# Altium schematic sheet PowerControl.SchDoc
size A4
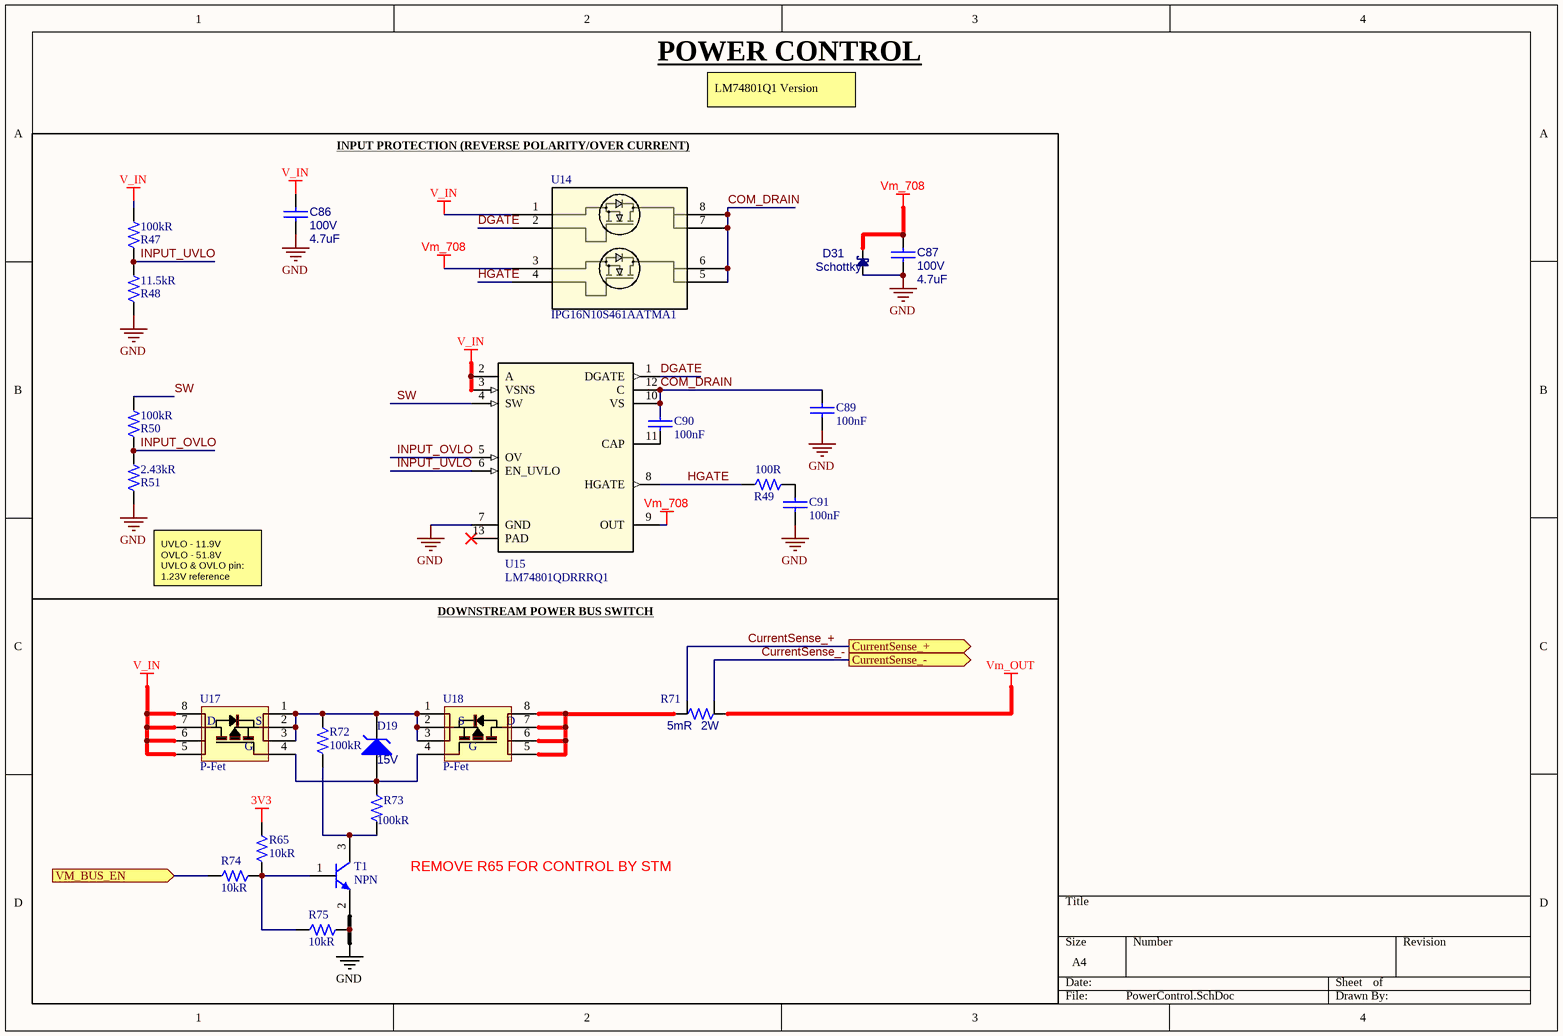
[diagram p0: PowerControl.SchDoc]

## Parts
C86  value 4.7uF  Voltage: 100V  [CAP1210]  (hidden comment: Capacitor)
C87  value 4.7uF  Voltage: 100V  [CAP1210]  (hidden comment: Capacitor)
C89  Capacitance: 100nF  [CAP0402]  (hidden comment: Capacitor)
C90  Capacitance: 100nF  [CAP0402]  (hidden comment: Capacitor)
C91  Capacitance: 100nF  [CAP0402]  (hidden comment: Capacitor)
D19  Zener Voltage: 15V  [SOD-323F]  (hidden comment: Zener)
D31  Schottky  [DO-214AC]
R47  Resistance: 100kR  [RES0402]  (hidden comment: Resistor)
R48  Resistance: 11.5kR  [RES0402]  (hidden comment: Resistor)
R49  Resistance: 100R  [RES0402]  (hidden comment: Resistor)
R50  Resistance: 100kR  [RES0402]  (hidden comment: Resistor)
R51  Resistance: 2.43kR  [RES0402]  (hidden comment: Resistor)
R65  Resistance: 10kR  [RES0402]  (hidden comment: Resistor)
R71  Resistance: 5mR  Power Rating: 2W  [RES2512 - KELVIN]  (hidden comment: Resistor_Kelvin)
R72  Resistance: 100kR  [RES0402]  (hidden comment: Resistor)
R73  Resistance: 100kR  [RES0402]  (hidden comment: Resistor)
R74  Resistance: 10kR  [RES0402]  (hidden comment: Resistor)
R75  Resistance: 10kR  [RES0402]  (hidden comment: Resistor)
T1  NPN  [DFN2020D-3]
U14  IPG16N10S461AATMA1  [PG-TDSON-8-4_INF]
U15  LM74801QDRRRQ1  [DRR0012E]
U17  P-Fet  [SO-8_PowerPAK]
U18  P-Fet  [SO-8_PowerPAK]

## Blocks framed on the sheet
INPUT PROTECTION (REVERSE POLARITY/OVER CURRENT): C86 C87 C89-C91 D31 R47-R51 U14 U15
REMOVE R65 FOR CONTROL BY STM: D19 R65 R71-R75 T1 U17 U18

## Ports
CurrentSense_+ (out), CurrentSense_- (out), VM_BUS_EN (in)

## Nets
3V3: R65.2
GND: C86.2 C87.2 C89.2 C91.2 D31.2 R48.1 R51.1 R75.2 T1.2(E) U15.7(GND)
V_IN: C86.1 R47.2 U14.1 U15.2(A) U15.3(VSNS) U17.5 U17.6 U17.7 U17.8
Vm_708: C87.1 D31.1 U14.3 U15.9(OUT)
Vm_OUT: R71.2
COM_DRAIN: C89.1 C90.1 U14.5 U14.6 U14.7 U14.8 U15.10(VS) U15.12(C)
CurrentSense_+: R71.3 ; port CurrentSense_+
CurrentSense_-: R71.4 ; port CurrentSense_-
DGATE: U14.2 U15.1(DGATE)
HGATE: R49.2 U14.4 U15.8(HGATE)
INPUT_OVLO: R50.1 R51.2 U15.5(OV)
INPUT_UVLO: R47.1 R48.2 U15.6(EN_UVLO)
SW: R50.2 U15.4(SW)
VM_BUS_EN: R74.1 ; port VM_BUS_EN
NetC90_2: C90.2 U15.11(CAP)
NetC91_1: C91.1 R49.1
NetD19_1: D19.1 R72.1 U17.1(G) U17.2(S) U17.3(D) U18.1(G) U18.2(S) U18.3(D)
NetD19_2: D19.2 R73.1 U17.4 U18.4
NetR65_1: R65.1 R74.2 R75.1 T1.1(B)
NetR71_1: R71.1 U18.5 U18.6 U18.7 U18.8
NetR72_2: R72.2 R73.2 T1.3(C)

Not connected (* = marked no-connect by the designer): U15 13(PAD)*

## Notes on the sheet
- POWER CONTROL
- LM74801Q1 Version
- (near R51) UVLO - 11.9V
  OVLO - 51.8V
  UVLO & OVLO pin:
  1.23V reference
- DOWNSTREAM POWER BUS SWITCH

## Library data of the parts
C86 C87 = Capacitor: Cap Ceramic 4.7uF 100V X7S 10% Pad SMD 1210 Soft Termination 125°C Automotive T/R; Manufacturer 1: Murata; Manufacturer Part Number 1: GCJ32DC72A475KE01L; Manufacturer: *; Manufacturer Part Number: *; Supplier: *; Supplier Part Number: *; Tolerance: 10%; Footprint: 1210; Temperature Coefficient: X7S; Supplier 1: Digi-Key; Supplier Part Number 1: 490-16466-1-ND; RoHS: Yes; Category: Ceramic Capacitors; Pricing 1: 1=1,37000, 10=1,07800, 50=0,93460, 100=0,80890, 500=0,61114 (USD); RoHS Compliant: Yes; ComponentLink1URL: https://search.murata.co.jp/Ceramy/image/img/A01X/G101/ENG/GCJ32DC72A475KE01-01.pdf?src-supplier=Digi-Key; ComponentLink1Description: https://search.murata.co.jp/Ceramy/image/img/A01X/G101/ENG/GCJ32DC72A475KE01-01.pdf?src-supplier=Digi-Key
C89-C91 = Capacitor: Cap Ceramic 0.1uF 35V X7R 20% SMD 0402 125°C Punched Paper T/R; Manufacturer: *; Manufacturer Part Number: *; Supplier: *; Supplier Part Number: *; Tolerance: *; Voltage: *; Footprint: *; Temperature Coefficient: *; Supplier 1: Digi-Key; Supplier Part Number 1: 445-12264-1-ND; RoHS: Yes; Category: Ceramic Capacitors; Stock 1: 20636; Pricing 1: 1=0.14000, 10=0.10200, 50=0.05780, 100=0.04780, 500=0.03356, 1000=0.02778, 2500=0.02585, 5000=0.02365 (USD); Mount: Surface Mount; Case/Package: 0402; Case Code (Metric): 1005; Case Code (Imperial): 0402; Weight: 2.3E-05oz; Min Operating Temperature: -55°C; Max Operating Temperature: 125°C; Voltage Rating: 35V; Package Quantity: 10000; Packaging: Tape and Reel; Dielectric: X7R; Voltage Rating (DC): 35V; Series: CGA; Length: 0.039inch; Width: 0.02inch; Height: 0.5mm; Thickness: 0.022inch; Ratings: AEC-Q200; RoHS Compliant: Yes; ComponentLink1URL: http://www.mouser.com/ds/2/400/lcc_automotive_general_en-843974.pdf?src-supplier=Mouser; ComponentLink1Description: http://www.mouser.com/ds/2/400/lcc_automotive_general_en-843974.pdf?src-supplier=Mouser; ComponentLink2URL: https://product.tdk.com/info/en/catalog/datasheets/mlcc_automotive_general_en.pdf?src-supplier=Digi-Key; ComponentLink2Description: https://product.tdk.com/info/en/catalog/datasheets/mlcc_automotive_general_en.pdf?src-supplier=Digi-Key; ComponentLink3URL: https://product.tdk.com/info/en/documents/chara_sheet/CGA2B3X7R1V104M050BB.pdf?src-supplier=Digi-Key; ComponentLink3Description: https://product.tdk.com/info/en/documents/chara_sheet/CGA2B3X7R1V104M050BB.pdf?src-supplier=Digi-Key; ComponentLink4URL: http://product.tdk.com/en/catalog/datasheets/mlcc_automotive_general_en.pdf?src-supplier=Avnet; ComponentLink4Description: http://product.tdk.com/en/catalog/datasheets/mlcc_automotive_general_en.pdf?src-supplier=Avnet
D19 = Diode_Zener: Manufacturer 1: NXP Semiconductors; Manufacturer Part Number 1: BZX84J-B15.115; Power Dissopation: 500mW; Supplier 1: Digi-Key; Supplier Part Number 1: 1727-6257-1-ND; RoHS: No; Category: Zener Diodes; Stock 1: 78829; Pricing 1: 1=0,24000, 10=0,16700, 100=0,08150, 500=0,06798, 1000=0,04724 (USD); Packaging: Tape and Reel; Lead Free: Lead Free; Working Voltage: 15V; Voltage Rating (DC): 15V; Case/Package: *; Parameter 6: *
D31 = Diode_Shottky_2: DIODE SCHOTTKY 5A 60V SMA; Manufacturer 1: MCC; Manufacturer Part Number 1: SK56A-LTP; Supplier 1: Digi-Key; Supplier Part Number 1: SK56A-LTPMSCT-ND; RoHS: Yes; Category: Rectifier Diodes; Stock 1: 27361; Pricing 1: 1=0,51000, 10=0,41400, 100=0,28160, 500=0,21120, 1000=0,15840, 2000=0,14520 (USD); Mount: Surface Mount; Case/Package: SMA; Packaging: Tape and Reel; Average Rectified Current: 5A; Max Reverse Voltage (DC): 60V; RoHS Compliant: Yes; ComponentLink1URL: http://www.mccsemi.com/up_pdf/SK52A-L-SK510A-L(DO-214AC).pdf?src-supplier=Digi-Key; ComponentLink1Description: http://www.mccsemi.com/up_pdf/SK52A-L-SK510A-L(DO-214AC).pdf?src-supplier=Digi-Key
R47 R50 = Resistor: Res Thick Film 0402 100K Ohm 1% 0.063W(1/16W) ±100ppm/C Sulfur Resistant Pad SMD Automotive T/R; Manufacturer: Yageo; Manufacturer Part Number: AF0402FR-07100KL; Max Power Dissipation: 63mW; Temperature Coefficient: 100ppm/°C; Supplier 1: Digi-Key; Supplier Part Number 1: 13-AF0402FR-07100KLCT-ND; RoHS: Yes; Category: Chip SMD Resistors; Stock 1: 45999; Pricing 1: 1=0.10000, 10=0.06100, 100=0.02470, 1000=0.01109, 2500=0.00963, 5000=0.00795 (USD); Case/Package: 0402; Min Operating Temperature: -55°C; Max Operating Temperature: 155°C; Packaging: Tape and Reel; Resistor Type: Thick Film; Number of Terminations: 2; Tolerance: 1%; Features: Moisture Resistant,Anti-Sulfur; Length: 0.039inch; Width: 0.02inch; Height: 0.015inch; RoHS Compliant: Yes; ComponentLink1URL: http://www.yageo.com/documents/recent/PYu-AF_51_RoHS_L_5.pdf?src-supplier=Digi-Key; ComponentLink1Description: http://www.yageo.com/documents/recent/PYu-AF_51_RoHS_L_5.pdf?src-supplier=Digi-Key
R48 = Resistor: Res Thick Film 0402 11.5K Ohm 1% 0.063W(1/16W) ±100ppm/C Pad SMD Automotive T/R; Manufacturer: Yageo; Manufacturer Part Number: AC0402FR-0711K5L; Max Power Dissipation: 63mW; Temperature Coefficient: 100ppm/°C; Supplier 1: Digi-Key; Supplier Part Number 1: 13-AC0402FR-0711K5LCT-ND; RoHS: Yes; Category: Chip SMD Resistors; Stock 1: 58308; Pricing 1: 1=0.10000, 10=0.02200, 100=0.00900, 1000=0.00402, 2500=0.00349, 5000=0.00288 (USD); Case/Package: 0402; Min Operating Temperature: -55°C; Max Operating Temperature: 155°C; Packaging: Tape and Reel; Resistor Type: Thick Film; Number of Terminations: 2; Tolerance: 1%; Features: Moisture Resistant,Automotive AEC-Q200; Length: 0.039inch; Width: 0.02inch; Height: 0.015inch; RoHS Compliant: Yes; ComponentLink1URL: http://www.yageo.com/NewPortal/yageodocoutput?fileName=/pdf/R-Chip/PYu-AC_51_RoHS_L_6.pdf&src-supplier=Digi-Key; ComponentLink1Description: http://www.yageo.com/NewPortal/yageodocoutput?fileName=/pdf/R-Chip/PYu-AC_51_RoHS_L_6.pdf&src-supplier=Digi-Key
R49 = Resistor: Res Thick Film 0402 100 Ohm 0.5% 0.063W ±50ppm/°C Molded SMD Punched Carrier T/R; Manufacturer: Panasonic; Manufacturer Part Number: ERJ-2RHD1000X; Power Rating: 63mW; Voltage Rating: 50V; Supplier 1: Digi-Key; Supplier Part Number 1: P15983CT-ND; RoHS: Yes; Category: Chip SMD Resistors; Stock 1: 2; Pricing 1: 1=0.13000, 10=0.11400, 100=0.04370, 1000=0.01923, 2500=0.01661, 5000=0.01486 (USD); Mount: Surface Mount; Case/Package: 0402; Case Code (Imperial): 0402; Case Code (Metric): 1005; Contact Plating: Tin; Min Operating Temperature: -55°C; Max Operating Temperature: 125°C; Packaging: Tape and Reel; Tolerance: 0.5%; Package Quantity: 10000; Resistor Type: Thick Film; Termination: SMD/SMT; Temperature Coefficient: 50ppm/°C; Voltage Rating (DC): 50V; Features: Automotive AEC-Q200; Series: ERJ; Max Power Dissipation: 63mW; Number of Terminations: 2; Technology: THICK FILM; Resistance Tolerance: 0.5%; Length: 1mm; Width: 0.5mm; Height: 0.35mm; Depth: 0.5mm; Radiation Hardening: No; REACH SVHC: No SVHC; RoHS Compliant: Yes; ComponentLink1URL: https://datasheet.ciiva.com/46438/1678782-46438252.pdf?src-supplier=Element14; ComponentLink1Description: https://datasheet.ciiva.com/46438/1678782-46438252.pdf?src-supplier=Element14; ComponentLink2URL: https://datasheet.ciiva.com/24071/aoa0000ce2-24071912.pdf?src-supplier=Mouser; ComponentLink2Description: https://datasheet.ciiva.com/24071/aoa0000ce2-24071912.pdf?src-supplier=Mouser; ComponentLink3URL: https://datasheet.ciiva.com/9119/aoa0000ce2-9119196.pdf?src-supplier=Avnet; ComponentLink3Description: https://datasheet.ciiva.com/9119/aoa0000ce2-9119196.pdf?src-supplier=Avnet; ComponentLink4URL: https://datasheet.ciiva.com/43511/aoa0000ce2-43511452.pdf?src-supplier=Onlinecomponents.com; ComponentLink4Description: https://datasheet.ciiva.com/43511/aoa0000ce2-43511452.pdf?src-supplier=Onlinecomponents.com
R51 = Resistor: Res Anti Sulfur 0402 2.43K Ohm 1/16W 1% SMD; Manufacturer: Rohm; Manufacturer Part Number: TRR01MZPF2431; Max Power Dissipation: 63mW; Temperature Coefficient: 100ppm/°C; Supplier 1: Digi-Key; Supplier Part Number 1: RHM2.43KBHCT-ND; RoHS: Yes; Category: Chip SMD Resistors; Stock 1: 4242; Pricing 1: 1=0.16000, 10=0.14100, 100=0.05420, 1000=0.02386, 2500=0.02060, 5000=0.01844 (USD); Case/Package: 0402; Case Code (Metric): 1005; Case Code (Imperial): 0402; Min Operating Temperature: -55°C; Max Operating Temperature: 155°C; Package Quantity: 10000; Packaging: Tape and Reel; Tolerance: 1%; Resistor Type: Thick Film; Number of Terminations: 2; Features: Anti-Sulfur; Series: TRR; Length: 0.039inch; Width: 0.02inch; Height: 0.016inch; RoHS Compliant: Yes; ComponentLink1URL: http://rohmfs.rohm.com/en/products/databook/datasheet-nrnd/passive/resistor/chip_resistor/trr-e.pdf?src-supplier=Digi-Key; ComponentLink1Description: http://rohmfs.rohm.com/en/products/databook/datasheet-nrnd/passive/resistor/chip_resistor/trr-e.pdf?src-supplier=Digi-Key
R65 R74 R75 = Resistor: Manufacturer 1: Panasonic; Manufacturer Part Number 1: ERJ-2RKF1002X; Power Rating: 100mW; Tolerance: 1%; Voltage Rating: 50V; Temperature Coefficient: 100ppm/°C; Supplier 1: Digi-Key; Supplier Part Number 1: P10.0KLDKR-ND; Stock 1: 3290329; Pricing 1: 1=0,10000, 10=0,04100, 100=0,01680, 1000=0,00753, 2500=0,00653, 5000=0,00540 (USD); RoHS: Yes; Mount: Surface Mount; Case/Package: 0402; Number of Pins: 2; Contact Plating: Tin; Case Code (Metric): 1005; Case Code (Imperial): 0402; Min Operating Temperature: -55°C; Max Operating Temperature: 155°C; Packaging: Tape and Reel; Package Quantity: 1; Voltage Rating (DC): 50V; Features: Automotive AEC-Q200; Max Power Dissipation: 100mW; Composition: Thick Film; Number of Terminations: 2; Termination: SMD/SMT; Military Standard: Not; Length: 1mm; Height: 0.35mm; Width: 0.02inch; Depth: 0.5mm; Radiation Hardening: No; Lead Free: Lead Free; REACH SVHC: No SVHC; ComponentLink1URL: https://datasheet.ciiva.com/11821/0900766b80f80784-11821171.pdf?src-supplier=RSComponents; ComponentLink1Description: https://datasheet.ciiva.com/11821/0900766b80f80784-11821171.pdf?src-supplier=RSComponents; ComponentLink2URL: https://datasheet.ciiva.com/16199/aoa0000ce2-16199478.pdf?src-supplier=Future+Electronics; ComponentLink2Description: https://datasheet.ciiva.com/16199/aoa0000ce2-16199478.pdf?src-supplier=Future+Electronics; ComponentLink3URL: https://datasheet.ciiva.com/17212/aoa0000ce2-17212102.pdf?src-supplier=Avnet+Europe; ComponentLink3Description: https://datasheet.ciiva.com/17212/aoa0000ce2-17212102.pdf?src-supplier=Avnet+Europe; ComponentLink4URL: https://datasheet.ciiva.com/24023/aoa0000ce2-24023017.pdf?src-supplier=Mouser; ComponentLink4Description: https://datasheet.ciiva.com/24023/aoa0000ce2-24023017.pdf?src-supplier=Mouser; ComponentLink5URL: https://datasheet.ciiva.com/28514/1678782-28514185.pdf?src-supplier=Element14; ComponentLink5Description: https://datasheet.ciiva.com/28514/1678782-28514185.pdf?src-supplier=Element14; ComponentLink6URL: https://datasheet.ciiva.com/43467/1678782-43467402.pdf?src-supplier=Farnell; ComponentLink6Description: https://datasheet.ciiva.com/43467/1678782-43467402.pdf?src-supplier=Farnell; ComponentLink7URL: https://datasheet.ciiva.com/27055/1987020-27055643.pdf?src-supplier=Jameco; ComponentLink7Description: https://datasheet.ciiva.com/27055/1987020-27055643.pdf?src-supplier=Jameco; ComponentLink8URL: https://datasheet.ciiva.com/48531/aoa0000ce2-48531069.pdf?src-supplier=Avnet; ComponentLink8Description: https://datasheet.ciiva.com/48531/aoa0000ce2-48531069.pdf?src-supplier=Avnet; ComponentLink9URL: https://datasheet.ciiva.com/9194/aoa0000ce2-9194142.pdf?src-supplier=Avnet; ComponentLink9Description: https://datasheet.ciiva.com/9194/aoa0000ce2-9194142.pdf?src-supplier=Avnet; ComponentLink10URL: https://datasheet.ciiva.com/16782/70260748-16782590.pdf?src-supplier=Allied+Electronics; ComponentLink10Description: https://datasheet.ciiva.com/16782/70260748-16782590.pdf?src-supplier=Allied+Electronics; ComponentLink11URL: https://datasheet.ciiva.com/16786/70260748-16786734.pdf?src-supplier=Allied+Electronics; ComponentLink11Description: https://datasheet.ciiva.com/16786/70260748-16786734.pdf?src-supplier=Allied+Electronics; ComponentLink12URL: https://datasheet.ciiva.com/30201/aoa0000ce2-30201022.pdf?src-supplier=Onlinecomponents.com; ComponentLink12Description: https://datasheet.ciiva.com/30201/aoa0000ce2-30201022.pdf?src-supplier=Onlinecomponents.com
R71 = Resistor_Kelvin: RES 0.005 OHM 1% 2W 2512; Manufacturer 1: Rohm; Manufacturer Part Number 1: PMR100HZPFU5L00; Temperature Coefficient: 100ppm/°C; Supplier 1: Digi-Key; Supplier Part Number 1: RHM.005AUCT-ND; RoHS: Yes; Category: Chip SMD Resistors; Stock 1: 205808; Pricing 1: 1=0,70000, 10=0,51800, 25=0,42080, 50=0,36600, 100=0,30200, 250=0,26232, 500=0,21350, 1000=0,16934 (USD); Case/Package: 2512; Case Code (Metric): 6432; Case Code (Imperial): 2512; Contact Plating: Tin; Min Operating Temperature: -55°C; Max Operating Temperature: 155°C; Tolerance: 1%; Package Quantity: 1; Packaging: Tape and Reel; Resistor Type: Thick Film; Number of Terminations: 2; Max Power Dissipation: 2W; Features: Automotive AEC-Q200; Series: PMR; Length: 0.252inch; Width: 0.126inch; Height: 0.026inch; Lead Free: Lead Free; RoHS Compliant: Yes; ComponentLink1URL: https://datasheet.ciiva.com/2481/pmr-2481532.pdf?src-supplier=Digi-Key; ComponentLink1Description: https://datasheet.ciiva.com/2481/pmr-2481532.pdf?src-supplier=Digi-Key; ComponentLink2URL: https://datasheet.ciiva.com/2481/pmr-2481533.pdf?src-supplier=Digi-Key; ComponentLink2Description: https://datasheet.ciiva.com/2481/pmr-2481533.pdf?src-supplier=Digi-Key; ComponentLink3URL: https://datasheet.ciiva.com/2481/pmr-2481534.pdf?src-supplier=Digi-Key; ComponentLink3Description: https://datasheet.ciiva.com/2481/pmr-2481534.pdf?src-supplier=Digi-Key
R72 R73 = Resistor: Manufacturer 1: Yageo; Manufacturer Part Number 1: RC0402FR-07100KL; Tolerance: 1%; Temperature Coefficient: 100ppm/°C; Power Rating: 63mW; Voltage Rating: 50V; Supplier 1: Digi-Key; Supplier Part Number 1: 311-100KLRDKR-ND; Stock 1: 20416104; Pricing 1: 1=0,10000, 10=0,01600, 100=0,00640, 1000=0,00289, 2500=0,00251, 5000=0,00207 (USD); RoHS: Yes; Case/Package: 0402; Case Code (Metric): 1005; Case Code (Imperial): 0402; Min Operating Temperature: -55°C; Max Operating Temperature: 155°C; Composition: Thick Film; Packaging: Tape and Reel; Package Quantity: 1; Max Power Dissipation: 63mW; Working Voltage: 50V; Features: Moisture Resistant; Number of Terminations: 2; Termination: SMD/SMT; Military Standard: Not; Length: 0.039inch; Height: 0.016inch; Width: 0.02inch; Depth: 0.5mm; Lead Free: Lead Free; REACH SVHC: No SVHC; ComponentLink1URL: https://datasheet.ciiva.com/11819/0900766b80c66297-11819452.pdf?src-supplier=RSComponents; ComponentLink1Description: https://datasheet.ciiva.com/11819/0900766b80c66297-11819452.pdf?src-supplier=RSComponents; ComponentLink2URL: https://datasheet.ciiva.com/2453/pyu-r-int-thick-7-2453361.pdf?src-supplier=Digi-Key; ComponentLink2Description: https://datasheet.ciiva.com/2453/pyu-r-int-thick-7-2453361.pdf?src-supplier=Digi-Key; ComponentLink3URL: https://datasheet.ciiva.com/2453/pyu-r-int-thick-7-2453362.pdf?src-supplier=Digi-Key; ComponentLink3Description: https://datasheet.ciiva.com/2453/pyu-r-int-thick-7-2453362.pdf?src-supplier=Digi-Key; ComponentLink4URL: https://datasheet.ciiva.com/2453/pyu-r-int-thick-7-2453363.pdf?src-supplier=Digi-Key; ComponentLink4Description: https://datasheet.ciiva.com/2453/pyu-r-int-thick-7-2453363.pdf?src-supplier=Digi-Key; ComponentLink5URL: https://datasheet.ciiva.com/22747/1018594-22747509.pdf?src-supplier=Element14; ComponentLink5Description: https://datasheet.ciiva.com/22747/1018594-22747509.pdf?src-supplier=Element14; ComponentLink6URL: https://datasheet.ciiva.com/15189/getdatasheetpartid-323696-15189334.pdf?src-supplier=Verical; ComponentLink6Description: https://datasheet.ciiva.com/15189/getdatasheetpartid-323696-15189334.pdf?src-supplier=Verical; ComponentLink7URL: https://datasheet.ciiva.com/12667/pyu-rc0402-51-rohs-l-6-r-12667930.pdf?src-supplier=Mouser; ComponentLink7Description: https://datasheet.ciiva.com/12667/pyu-rc0402-51-rohs-l-6-r-12667930.pdf?src-supplier=Mouser
T1 = NPN Transistor: Trans GP BJT NPN 80V 3-Pin SOT-1061D T/R; Manufacturer 1: NXP Semiconductors; Manufacturer Part Number 1: BC56-10PASX; Collector Base Voltage (VCBO): 100V; Emitter Base Voltage (VEBO): 5V; Max Collector Current: 1A; Collector Emitter Voltage (VCEO): 500mV; Max Power Dissipation: 420mW; Transition Frequency: 180MHz; Supplier 1: Digi-Key; Supplier Part Number 1: 1727-2349-1-ND; RoHS: Yes; Category: BJTs; Stock 1: 2894; Pricing 1: 1=0,46000, 10=0,32000, 25=0,29800, 100=0,16170, 500=0,13194, 1000=0,09789 (USD); Mount: Surface Mount; Case/Package: SMD/SMT; Number of Pins: 3; Contact Plating: Tin; Min Operating Temperature: -55°C; Max Operating Temperature: 150°C; Packaging: Tape and Reel; Collector Emitter Breakdown Voltage: 80V; Max Breakdown Voltage: 80V; ComponentLink1URL: http://www.nxp.com/documents/data_sheet/BC54_55_56PAS_SER.pdf?src-supplier=Avnet; ComponentLink1Description: http://www.nxp.com/documents/data_sheet/BC54_55_56PAS_SER.pdf?src-supplier=Avnet
U14 = IPG16N10S461AATMA1: MOSFET MOSFET_(75V 120V(; Mfr_Name: Infineon; Copyright: Copyright (C) 2021 Ultra Librarian. All rights reserved.; Manufacturer_Part_Number: IPG16N10S461AATMA1; RefDes: RefDes; Type: DEV
U15 = LM74800QDRRRQ1: No Description Available; Mfr_Name: Texas Instruments; Type: DEV; RefDes: RefDes; Copyright: Copyright (C) 2021 Ultra Librarian. All rights reserved.; Manufacturer_Part_Number: LM74800QDRRRQ1
U17 U18 = MOSFET - P - Single: Trans MOSFET P-CH 80V 10.2A 8-Pin PowerPAK SO T/R; Manufacturer 1: Vishay Siliconix; Manufacturer Part Number 1: SI7469DP-T1-E3; Rise Time: 220ns; Rds On Max: 25mR; Input Capacitance: 4.7nF; Number of Elements: 1; Element Configuration: Single; Current: 27A; Turn-On Delay Time: 45ns; Continuous Drain Current (ID): 28A; Gate to Source Voltage (Vgs): 20V; Max Power Dissipation: 83W; Fall Time: 110ns; Turn-Off Delay Time: 105ns; Drain to Source Voltage (Vdss): -80V; Threshold Voltage: -3V; Power Dissipation: 5.2W; Supplier 1: Digi-Key; Supplier Part Number 1: SI7469DP-T1-E3CT-ND; RoHS: Yes; Category: MOSFETs; Stock 1: 17352; Pricing 1: 1=2,66000, 10=2,21000, 25=2,13800, 100=1,75920, 500=1,48858, 1000=1,26303 (USD); Mount: Surface Mount; Number of Pins: 8; Weight: 0.01787oz; Min Operating Temperature: -55°C; Max Operating Temperature: 150°C; Package Quantity: 3000; Voltage: 80V; Number of Channels: 1; Drain to Source Resistance: 25mR; On-State Resistance: 25MR; Packaging: Tape and Reel; Length: 4.9mm; Width: 5.89mm; Height: 1.04mm; Lead Free: Lead Free; REACH SVHC: No SVHC; ComponentLink1URL: https://datasheet.ciiva.com/16217/si7469dp-16217521.pdf?src-supplier=Future+Electronics; ComponentLink1Description: https://datasheet.ciiva.com/16217/si7469dp-16217521.pdf?src-supplier=Future+Electronics; ComponentLink2URL: https://datasheet.ciiva.com/933/si7469dp-933865.pdf?src-supplier=Digi-Key; ComponentLink2Description: https://datasheet.ciiva.com/933/si7469dp-933865.pdf?src-supplier=Digi-Key; ComponentLink3URL: https://datasheet.ciiva.com/7710/si7469dp-7710284.pdf?src-supplier=Element14; ComponentLink3Description: https://datasheet.ciiva.com/7710/si7469dp-7710284.pdf?src-supplier=Element14; ComponentLink4URL: https://datasheet.ciiva.com/18432/70026415-18432556.pdf?src-supplier=Allied+Electronics; ComponentLink4Description: https://datasheet.ciiva.com/18432/70026415-18432556.pdf?src-supplier=Allied+Electronics; ComponentLink5URL: https://datasheet.ciiva.com/11159/si7469dp-11159781.pdf?src-supplier=Avnet; ComponentLink5Description: https://datasheet.ciiva.com/11159/si7469dp-11159781.pdf?src-supplier=Avnet; ComponentLink6URL: https://datasheet.ciiva.com/933/si7469dp-933864.pdf?src-supplier=Digi-Key; ComponentLink6Description: https://datasheet.ciiva.com/933/si7469dp-933864.pdf?src-supplier=Digi-Key; ComponentLink7URL: https://datasheet.ciiva.com/11161/si7469dp-11161528.pdf?src-supplier=Avnet; ComponentLink7Description: https://datasheet.ciiva.com/11161/si7469dp-11161528.pdf?src-supplier=Avnet; ComponentLink8URL: https://datasheet.ciiva.com/933/si7469dp-933866.pdf?src-supplier=Digi-Key; ComponentLink8Description: https://datasheet.ciiva.com/933/si7469dp-933866.pdf?src-supplier=Digi-Key